# Altium schematic sheet Sch_khech_dai_musis.SchDoc
size A
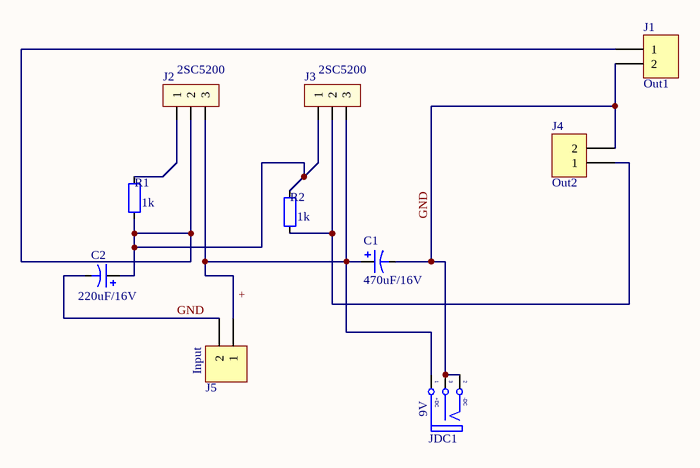
[diagram p0: Sch_khech_dai_musis.SchDoc]

## Parts
C1  470uF/16V  [C3MM]
C2  220uF/16V  [C3MM]
J1  Out1  [KF2-3.5]
J2  2SC5200  [JP3-C1T]
J3  2SC5200  [JP3-C1T]
J4  Out2  [KF2-3.5]
J5  Input  [KF2-3.5]
JDC1  9V  [DC-IN]
R1  1k  [RES-SMD-0805]
R2  1k  [RES-SMD-0805]

## Nets
+: C1.1 J2.3 J3.3 J5.1 JDC1.1(T)
GND: C1.2 C2.2 J1.2 J4.2 J5.2 JDC1.2(TN) JDC1.3(S)
NetC2_1: C2.1 J1.1 J2.2 J3.1 R1.1 R2.2
NetJ2_1: J2.1 R1.2
NetJ3_2: J3.2 J4.1 R2.1

## Notes on the sheet
- (in symbol DCIN) +DC; -DC

## Library data of the parts
C1 C2 = Cap Pol: Polarized Capacitor (Axial); Published: 8-Jun-2000; LatestRevisionDate: 17-Jul-2002; LatestRevisionNote: Re-released for DXP Platform.; PackageReference: POLAR0.8; Publisher: Altium Limited
J1 J4 J5 = KF2: Manufacturer: Würth Elektronik eiSos GmbH; partNo: 691103110002; ComponentLink1 Description: Manufacturer; ComponentLink2 Description: Datasheet; NoPins: 2; Created Date: 29 October 2013; ComponentLink1URL: http://www.we-online.com; ComponentLink2URL: http://katalog.we-online.de/em/datasheet/6911031100xx.pdf; Created by: Karrer Zheng
J2 J3 = JP3: Jumper 3; Value: J3
JDC1 = DCIN: Jac DC input; Value: Jac DC
R1 R2 = Resistor - SMD: Resistor; Manufacturer: Generic Components; Class: Passive; Published: 08/06/2000; Publisher: Altium Hobart Technology Centre